# EAGLE design New_SERV_OPEN8_SOTB (EAGLE 9.6.2)
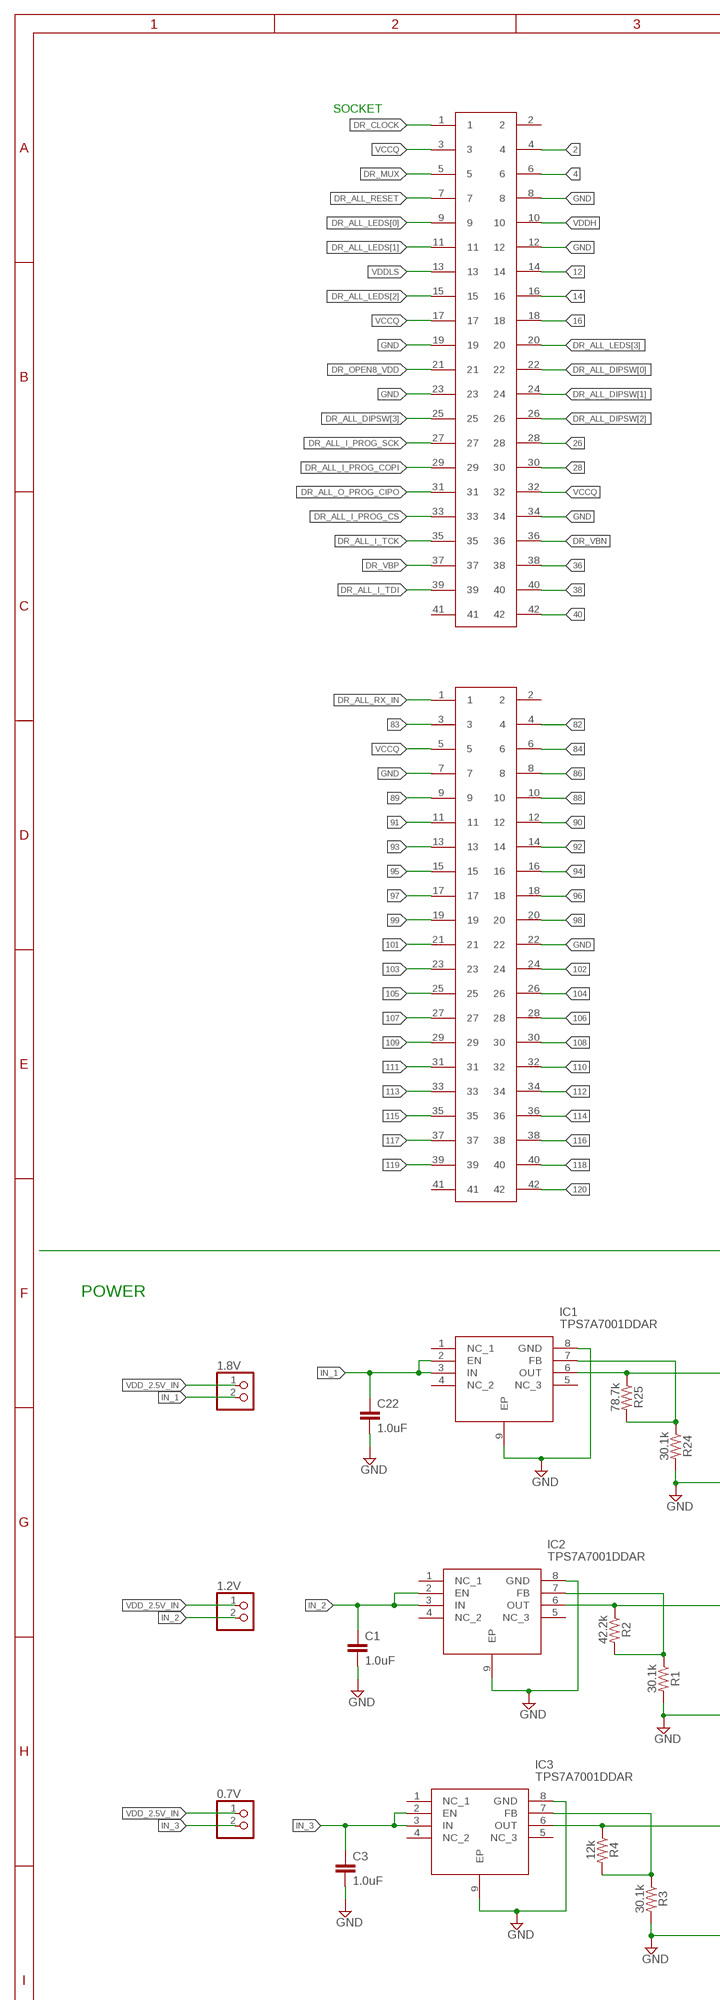
[diagram p0: schematic, sheet 1, part 1 of 2]
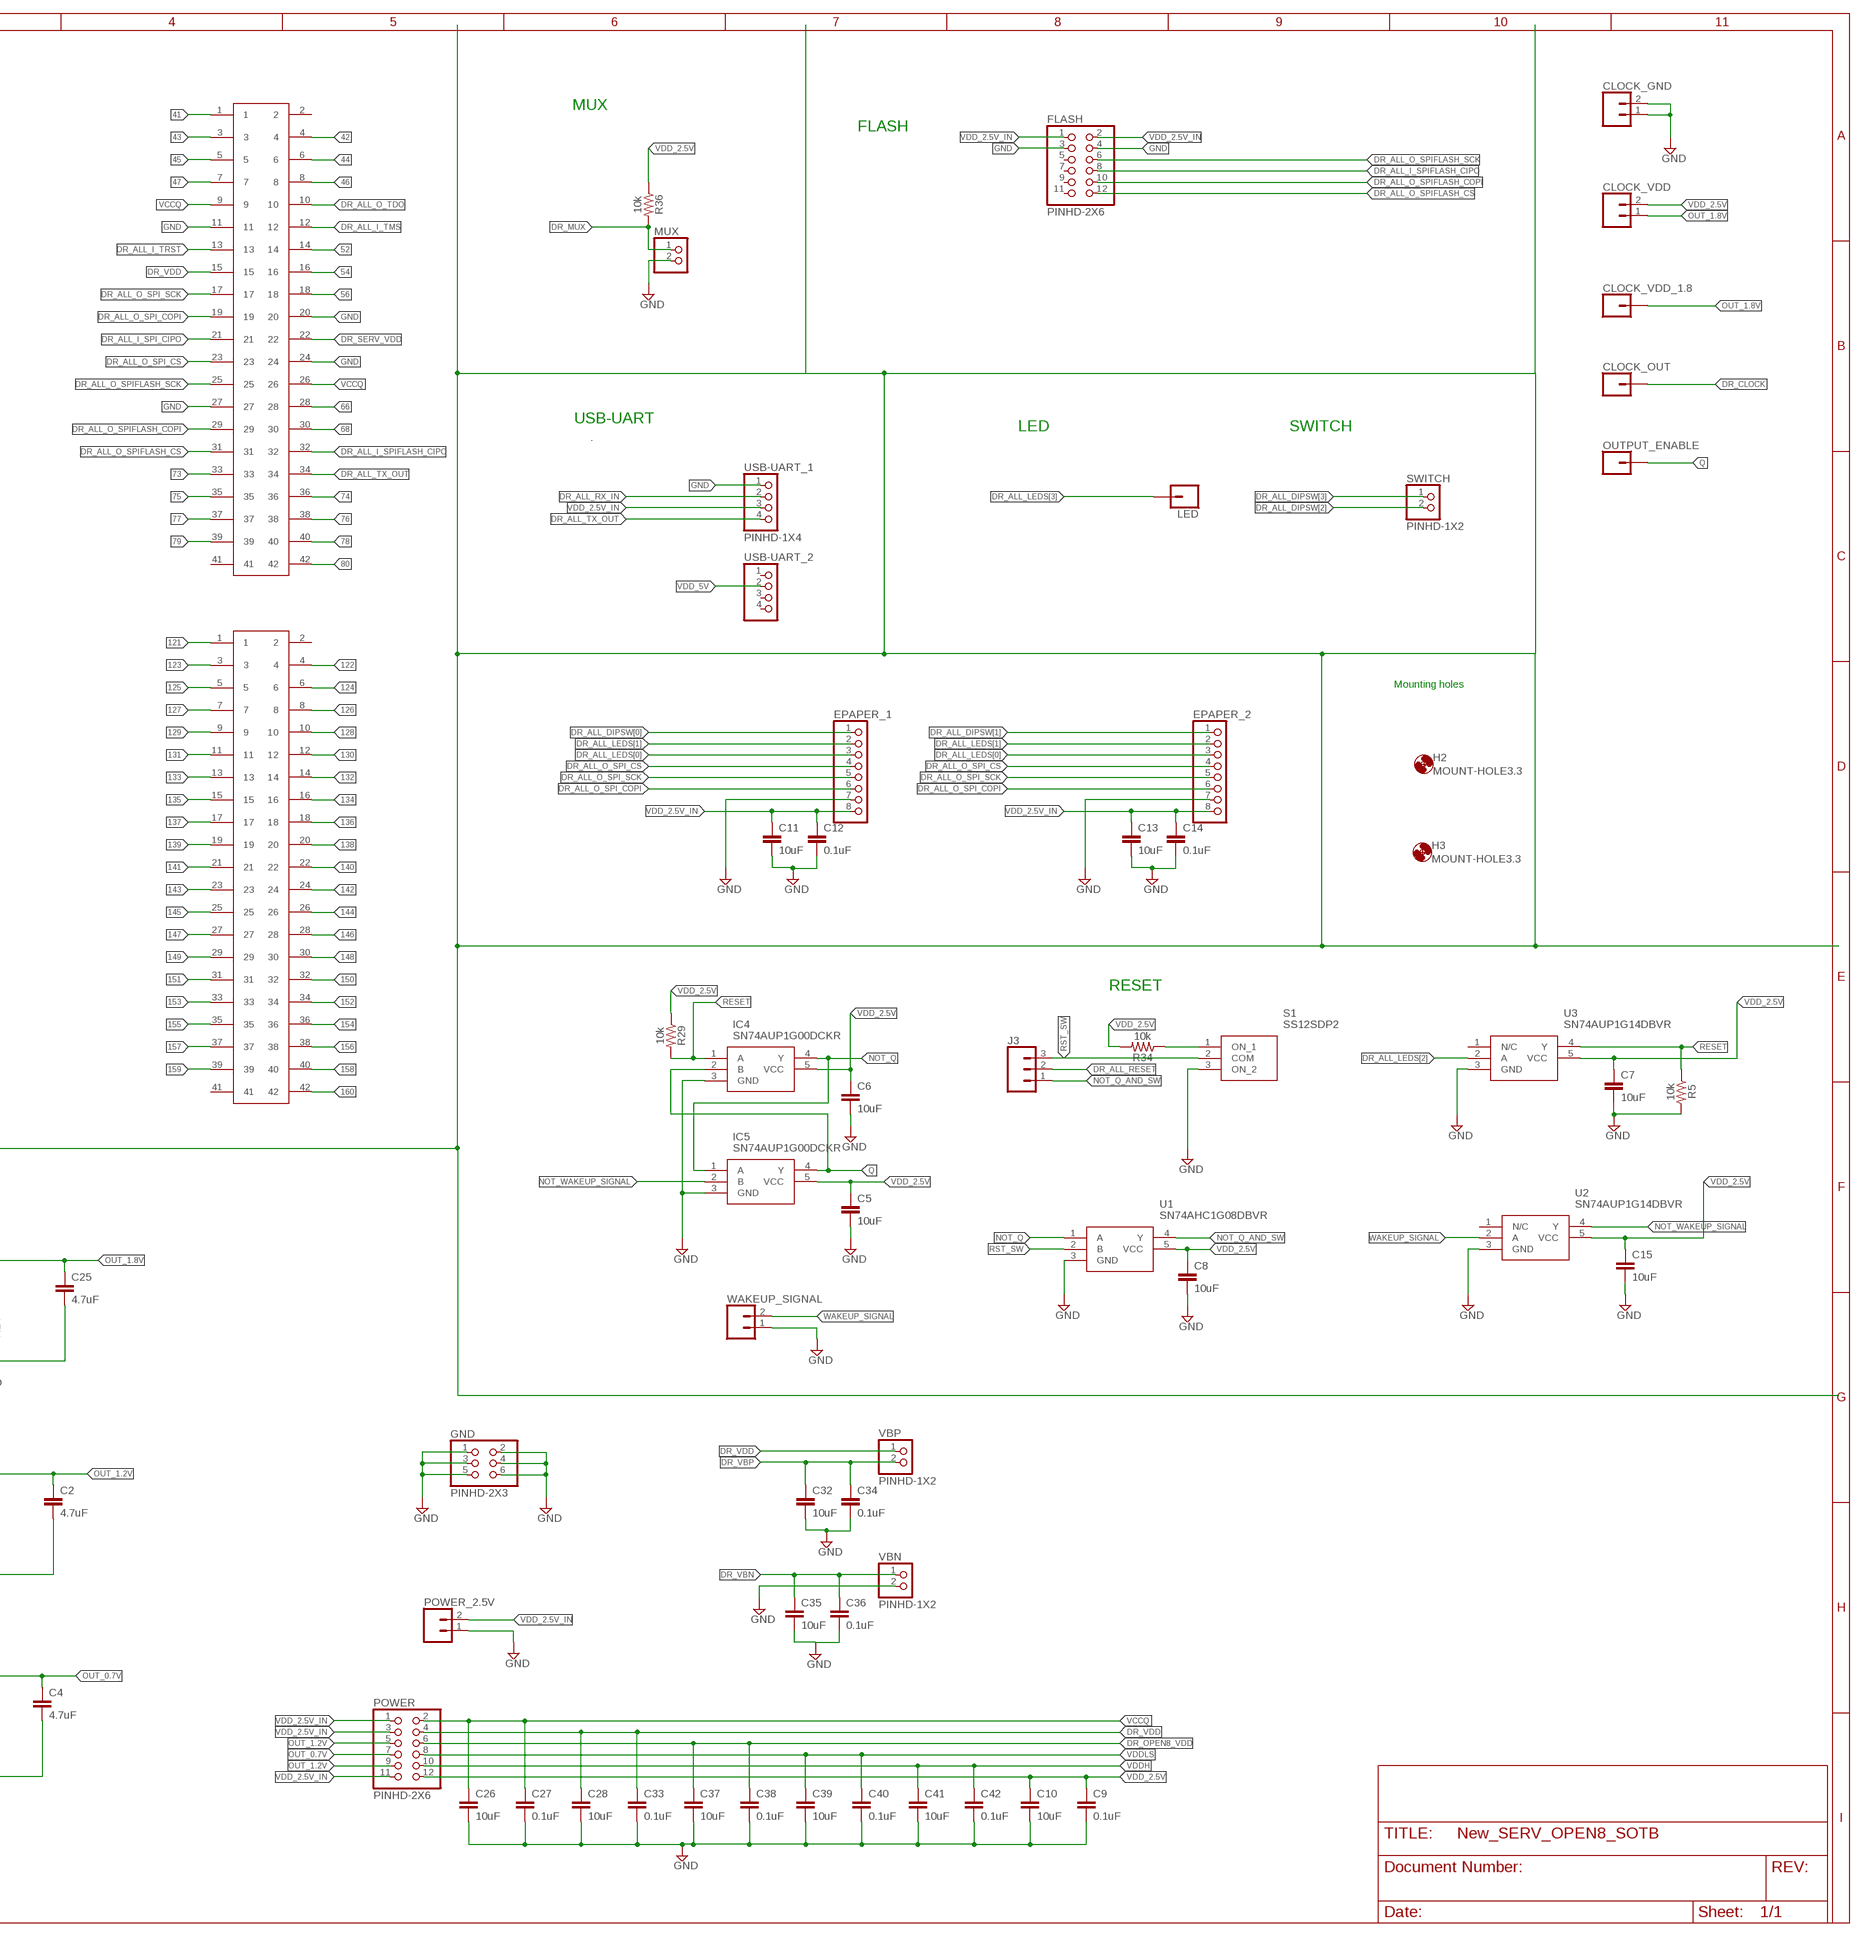
[diagram p1: schematic, sheet 1, part 2 of 2]

## Parts
0.7V  PINHD-1X2  [1X02]
1.2V  PINHD-1X2  [1X02]
1.8V  PINHD-1X2  [1X02]
C1  1.0uF  1.0UF-0805-25V-(+80/-20%)  [0805]
C2  4.7uF  1.0UF-0805-25V-(+80/-20%)  [0805]
C3  1.0uF  1.0UF-0805-25V-(+80/-20%)  [0805]
C4  4.7uF  1.0UF-0805-25V-(+80/-20%)  [0805]
C5  10uF  1.0UF-0805-25V-(+80/-20%)  [0805]
C6  10uF  1.0UF-0805-25V-(+80/-20%)  [0805]
C7  10uF  1.0UF-0805-25V-(+80/-20%)  [0805]
C8  10uF  1.0UF-0805-25V-(+80/-20%)  [0805]
C9  0.1uF  1.0UF-0805-25V-(+80/-20%)  [0805]
C10  10uF  1.0UF-0805-25V-(+80/-20%)  [0805]
C11  10uF  1.0UF-0805-25V-(+80/-20%)  [0805]
C12  0.1uF  1.0UF-0805-25V-(+80/-20%)  [0805]
C13  10uF  1.0UF-0805-25V-(+80/-20%)  [0805]
C14  0.1uF  1.0UF-0805-25V-(+80/-20%)  [0805]
C15  10uF  1.0UF-0805-25V-(+80/-20%)  [0805]
C22  1.0uF  1.0UF-0805-25V-(+80/-20%)  [0805]
C25  4.7uF  1.0UF-0805-25V-(+80/-20%)  [0805]
C26  10uF  1.0UF-0805-25V-(+80/-20%)  [0805]
C27  0.1uF  1.0UF-0805-25V-(+80/-20%)  [0805]
C28  10uF  1.0UF-0805-25V-(+80/-20%)  [0805]
C32  10uF  1.0UF-0805-25V-(+80/-20%)  [0805]
C33  0.1uF  1.0UF-0805-25V-(+80/-20%)  [0805]
C34  0.1uF  1.0UF-0805-25V-(+80/-20%)  [0805]
C35  10uF  1.0UF-0805-25V-(+80/-20%)  [0805]
C36  0.1uF  1.0UF-0805-25V-(+80/-20%)  [0805]
C37  10uF  1.0UF-0805-25V-(+80/-20%)  [0805]
C38  0.1uF  1.0UF-0805-25V-(+80/-20%)  [0805]
C39  10uF  1.0UF-0805-25V-(+80/-20%)  [0805]
C40  0.1uF  1.0UF-0805-25V-(+80/-20%)  [0805]
C41  10uF  1.0UF-0805-25V-(+80/-20%)  [0805]
C42  0.1uF  1.0UF-0805-25V-(+80/-20%)  [0805]
CLOCK_GND  CONN_02  [1X02]
CLOCK_OUT  CONN_01  [1X01]
CLOCK_VDD  CONN_02  [1X02]
CLOCK_VDD_1.8  CONN_01  [1X01]
EPAPER_1  PINHD-1X8  [1X08]
EPAPER_2  PINHD-1X8  [1X08]
FLASH  PINHD-2X6  [2X06]
GND  PINHD-2X3  [2X03]
H2  MOUNT-HOLE3.3  [3,3]
H3  MOUNT-HOLE3.3  [3,3]
IC1  TPS7A7001DDAR  [SOIC127P600X170-9N]
IC2  TPS7A7001DDAR  [SOIC127P600X170-9N]
IC3  TPS7A7001DDAR  [SOIC127P600X170-9N]
IC4  SN74AUP1G00DCKR  [SOT65P210X110-5N]
IC5  SN74AUP1G00DCKR  [SOT65P210X110-5N]
J3  CONN_03  [1X03]
LED  CONN_01  [1X01]
MUX  PINHD-1X2  [1X02]
OUTPUT_ENABLE  CONN_01  [1X01]
POWER  PINHD-2X6  [2X06]
POWER_2.5V  CONN_02  [1X02]
R1  30.1k  0.3OHM-0805-1/8W-1%  [0805]
R2  42.2k  0.3OHM-0805-1/8W-1%  [0805]
R3  30.1k  0.3OHM-0805-1/8W-1%  [0805]
R4  12k  0.3OHM-0805-1/8W-1%  [0805]
R5  10k  0.3OHM-0805-1/8W-1%  [0805]
R24  30.1k  0.3OHM-0805-1/8W-1%  [0805]
R25  78.7k  0.3OHM-0805-1/8W-1%  [0805]
R29  10k  0.3OHM-0805-1/8W-1%  [0805]
R34  10k  0.3OHM-0805-1/8W-1%  [0805]
R36  10k  0.3OHM-0805-1/8W-1%  [0805]
S1  SS12SDP2  [SS12SDP2]
SWITCH  PINHD-1X2  [1X02]
U1  SN74AHC1G08DBVR  [SOT95P280X145-5N]
U2  SN74AUP1G14DBVR  [SOT65P210X110-5N]
U3  SN74AUP1G14DBVR  [SOT65P210X110-5N]
U$1  2X41_HEADER  [2X41_HEADER]
U$2  2X41_HEADER  [2X41_HEADER]
U$3  2X41_HEADER  [2X41_HEADER]
U$4  2X41_HEADER  [2X41_HEADER]
USB-UART_1  PINHD-1X4  [1X04]
USB-UART_2  PINHD-1X4  [1X04]
VBN  PINHD-1X2  [1X02]
VBP  PINHD-1X2  [1X02]
WAKEUP_SIGNAL  CONN_02  [1X02]

## Nets
2: U$1.4
4: U$1.6
12: U$1.14
14: U$1.16
16: U$1.18
26: U$1.28
28: U$1.30
36: U$1.38
38: U$1.40
40: U$1.42
41: U$2.1
42: U$2.4
43: U$2.3
44: U$2.6
45: U$2.5
46: U$2.8
47: U$2.7
52: U$2.14
54: U$2.16
56: U$2.18
66: U$2.28
68: U$2.30
73: U$2.33
74: U$2.36
75: U$2.35
76: U$2.38
77: U$2.37
78: U$2.40
79: U$2.39
80: U$2.42
82: U$3.4
83: U$3.3
84: U$3.6
86: U$3.8
88: U$3.10
89: U$3.9
90: U$3.12
91: U$3.11
92: U$3.14
93: U$3.13
94: U$3.16
95: U$3.15
96: U$3.18
97: U$3.17
98: U$3.20
99: U$3.19
101: U$3.21
102: U$3.24
103: U$3.23
104: U$3.26
105: U$3.25
106: U$3.28
107: U$3.27
108: U$3.30
109: U$3.29
110: U$3.32
111: U$3.31
112: U$3.34
113: U$3.33
114: U$3.36
115: U$3.35
116: U$3.38
117: U$3.37
118: U$3.40
119: U$3.39
120: U$3.42
121: U$4.1
122: U$4.4
123: U$4.3
124: U$4.6
125: U$4.5
126: U$4.8
127: U$4.7
128: U$4.10
129: U$4.9
130: U$4.12
131: U$4.11
132: U$4.14
133: U$4.13
134: U$4.16
135: U$4.15
136: U$4.18
137: U$4.17
138: U$4.20
139: U$4.19
140: U$4.22
141: U$4.21
142: U$4.24
143: U$4.23
144: U$4.26
145: U$4.25
146: U$4.28
147: U$4.27
148: U$4.30
149: U$4.29
150: U$4.32
151: U$4.31
152: U$4.34
153: U$4.33
154: U$4.36
155: U$4.35
156: U$4.38
157: U$4.37
158: U$4.40
159: U$4.39
160: U$4.42
DR_ALL_DIPSW[0]: EPAPER_1.1 U$1.22
DR_ALL_DIPSW[1]: EPAPER_2.1 U$1.24
DR_ALL_DIPSW[2]: SWITCH.2 U$1.26
DR_ALL_DIPSW[3]: SWITCH.1 U$1.25
DR_ALL_I_PROG_COPI: U$1.29
DR_ALL_I_PROG_CS: U$1.33
DR_ALL_I_PROG_SCK: U$1.27
DR_ALL_I_SPI_CIPO: U$2.21
DR_ALL_I_SPIFLASH_CIPO: FLASH.8 U$2.32
DR_ALL_I_TCK: U$1.35
DR_ALL_I_TDI: U$1.39
DR_ALL_I_TMS: U$2.12
DR_ALL_I_TRST: U$2.13
DR_ALL_LEDS[0]: EPAPER_1.3 EPAPER_2.3 U$1.9
DR_ALL_LEDS[1]: EPAPER_1.2 EPAPER_2.2 U$1.11
DR_ALL_LEDS[2]: U3.2(A) U$1.15
DR_ALL_LEDS[3]: LED.1 U$1.20
DR_ALL_O_PROG_CIPO: U$1.31
DR_ALL_O_SPI_COPI: EPAPER_1.6 EPAPER_2.6 U$2.19
DR_ALL_O_SPI_CS: EPAPER_1.4 EPAPER_2.4 U$2.23
DR_ALL_O_SPI_SCK: EPAPER_1.5 EPAPER_2.5 U$2.17
DR_ALL_O_SPIFLASH_COPI: FLASH.10 U$2.29
DR_ALL_O_SPIFLASH_CS: FLASH.12 U$2.31
DR_ALL_O_SPIFLASH_SCK: FLASH.6 U$2.25
DR_ALL_O_TDO: U$2.10
DR_ALL_RESET: J3.2 U$1.7
DR_ALL_RX_IN: U$3.1 USB-UART_1.2
DR_ALL_TX_OUT: U$2.34 USB-UART_1.4
DR_CLOCK: CLOCK_OUT.1 U$1.1
DR_MUX: MUX.1 R36.2 U$1.5
DR_OPEN8_VDD: C37.1 C38.1 POWER.6 U$1.21
DR_SERV_VDD: U$2.22
DR_VBN: C35.1 C36.1 U$1.36 VBN.1
DR_VBP: C32.1 C34.1 U$1.37 VBP.2
DR_VDD: C28.1 C33.1 POWER.4 U$2.15 VBP.1
GND: C1.2 C2.2 C3.2 C4.2 C5.2 C6.2 C7.2 C8.2 C9.2 C10.2 C11.2 C12.2 C13.2 C14.2 C15.2 C22.2 C25.2 C26.2 C27.2 C28.2 C32.2 C33.2 C34.2 C35.2 C36.2 C37.2 C38.2 C39.2 C40.2 C41.2 C42.2 CLOCK_GND.1 CLOCK_GND.2 EPAPER_1.7 EPAPER_2.7 FLASH.3 FLASH.4 GND.1 GND.2 GND.3 GND.4 GND.5 GND.6 IC1.8(GND) IC1.9(EP) IC2.8(GND) IC2.9(EP) IC3.8(GND) IC3.9(EP) IC4.3(GND) IC5.3(GND) MUX.2 POWER_2.5V.1 R1.2 R3.2 R5.2 R24.2 S1.3(ON_2) U1.3(GND) U2.3(GND) U3.3(GND) U$1.8 U$1.12 U$1.19 U$1.23 U$1.34 U$2.11 U$2.20 U$2.24 U$2.27 U$3.7 U$3.22 USB-UART_1.1 VBN.2 WAKEUP_SIGNAL.1
IN_1: 1.8V.2 C22.1 IC1.2(EN) IC1.3(IN)
IN_2: 1.2V.2 C1.1 IC2.2(EN) IC2.3(IN)
IN_3: 0.7V.2 C3.1 IC3.2(EN) IC3.3(IN)
N$1: IC2.7(FB) R1.1 R2.2
N$2: IC3.7(FB) R3.1 R4.2
N$10: R34.1 S1.1(ON_1)
N$18: IC1.7(FB) R24.1 R25.2
NOT_Q: IC4.4(Y) IC5.1(A) U1.1(A)
NOT_Q_AND_SW: J3.1 U1.4(Y)
NOT_WAKEUP_SIGNAL: IC5.2(B) U2.4(Y)
OUT_0.7V: C4.1 IC3.6(OUT) POWER.7 R4.1
OUT_1.2V: C2.1 IC2.6(OUT) POWER.5 POWER.9 R2.1
OUT_1.8V: C25.1 CLOCK_VDD.1 CLOCK_VDD_1.8.1 IC1.6(OUT) R25.1
Q: IC4.2(B) IC5.4(Y) OUTPUT_ENABLE.1
RESET: IC4.1(A) R5.1 R29.2 U3.4(Y)
RST_SW: J3.3 S1.2(COM) U1.2(B)
VCCQ: C26.1 C27.1 POWER.2 U$1.3 U$1.17 U$1.32 U$2.9 U$2.26 U$3.5
VDD_2.5V: C5.1 C6.1 C7.1 C8.1 C9.1 C10.1 C15.1 CLOCK_VDD.2 IC4.5(VCC) IC5.5(VCC) POWER.12 R29.1 R34.2 R36.1 U1.5(VCC) U2.5(VCC) U3.5(VCC)
VDD_2.5V_IN: 0.7V.1 1.2V.1 1.8V.1 C11.1 C12.1 C13.1 C14.1 EPAPER_1.8 EPAPER_2.8 FLASH.1 FLASH.2 POWER.1 POWER.3 POWER.11 POWER_2.5V.2 USB-UART_1.3
VDD_5V: USB-UART_2.2
VDDH: C41.1 C42.1 POWER.10 U$1.10
VDDLS: C39.1 C40.1 POWER.8 U$1.13
WAKEUP_SIGNAL: U2.2(A) WAKEUP_SIGNAL.2
Unconnected: FLASH.5 FLASH.7 FLASH.9 FLASH.11 IC1.1(NC_1) IC1.4(NC_2) IC1.5(NC_3) IC2.1(NC_1) IC2.4(NC_2) IC2.5(NC_3) IC3.1(NC_1) IC3.4(NC_2) IC3.5(NC_3) U2.1(N/C) U3.1(N/C) U$1.2 U$1.41 U$2.2 U$2.41 U$3.2 U$3.41 U$4.2 U$4.41 USB-UART_2.1 USB-UART_2.3 USB-UART_2.4

## Notes on the sheet
- SOCKET
- MUX
- FLASH
- USB-UART
- LED | SWITCH
- Mounting holes
- RESET
- POWER

## Library data of the parts
0.7V 1.2V 1.8V MUX = pinhead:PINHD-1X2: PIN HEADER
C1 C3 C22 = SparkFun-Capacitors:1.0UF: 1µF ceramic capacitors A capacitor is a passive two-terminal electrical component used to store electrical energy temporarily in an electric field.; PROD_ID: CAP-11625
C2 C4-C15 C25-C28 C32-C42 = SparkFun-Capacitors:1.0UF: 1µF ceramic capacitors A capacitor is a passive two-terminal electrical component used to store electrical energy temporarily in an electric field.; PROD_ID: CAP-11625; VALUE: 1.0uF
CLOCK_GND CLOCK_VDD POWER_2.5V WAKEUP_SIGNAL = SparkFun-Connectors:CONN_02: Multi connection point. Often used as Generic Header-pin footprint for 0.1 inch spaced/style header connections On any of the 0.1 inch spaced packages, you can populate with these: Break Away Headers - Straight <https://www.sparkfun.com/products/116> (PRT-00116) Break Away Male Headers - Right Angle <https://www.sparkfun.com/products/553> (PRT-00553) Female Headers <https://www.sparkfun.com/products/115> (PRT-00115) Break Away Headers - Machine Pin <https://www.sparkfun.com/products/117> (PRT-00117) Break Away Female Headers - Swiss Machine Pin <https://www.sparkfun.com/products/743> (PRT-00743) For SCREWTERMINALS and SPRING TERMINALS visit here: Screw Terimnals on SparkFun.com <https://www.sparkfun.com/search/results?term=Screw+Terminals> (5mm/3.5mm/2.54mm spacing) This device is also useful as a general connection point to wire up your design to another part of your project. Our various solder wires solder well into these plated through hole pads. Hook-Up Wire - Assortment (Stranded, 22 AWG) <https://www.sparkfun.com/products/11375> (PRT-11375) Hook-Up Wire - Assortment (Solid Core, 22 AWG) <https://www.sparkfun.com/products/11367> (PRT-11367) View the entire wire category on our website here <https://www.sparkfun.com/categories/141> Special notes: Molex polarized connector foot print use with: PRT-08233 with associated crimp pins and housings. 2.54_SCREWTERM for use with PRT-10571. 3.5mm Screw Terminal footprints for PRT-08084 5mm Screw Terminal footprints for use with PRT-08432
CLOCK_OUT CLOCK_VDD_1.8 LED OUTPUT_ENABLE = SparkFun-Connectors:CONN_01: Single connection point. Often used as Generic Header-pin footprint for 0.1 inch spaced/style header connections On any of the 0.1 inch spaced packages, you can populate with these: Break Away Headers - Straight <https://www.sparkfun.com/products/116> (PRT-00116) Break Away Male Headers - Right Angle <https://www.sparkfun.com/products/553> (PRT-00553) Female Headers <https://www.sparkfun.com/products/115> (PRT-00115) Break Away Headers - Machine Pin <https://www.sparkfun.com/products/117> (PRT-00117) Break Away Female Headers - Swiss Machine Pin <https://www.sparkfun.com/products/743> (PRT-00743) This device is also useful as a general connection point to wire up your design to another part of your project. Our various solder wires solder well into these plated through hole pads. Hook-Up Wire - Assortment (Stranded, 22 AWG) <https://www.sparkfun.com/products/11375> (PRT-11375) Hook-Up Wire - Assortment (Solid Core, 22 AWG) <https://www.sparkfun.com/products/11367> (PRT-11367) View the entire wire category on our website here <https://www.sparkfun.com/categories/141> Special notes: SMTSO-256-ET is a "flush mount" nut for a 4-40 screw. We mostly use this on specialty testbeds; it is a nice way to connect hardware to your PCB at an adjustable hieght. Also note, the SNAP packages are for using a snappable style connector. We sell a baggie of snaps and they are also used on two LilyPad designs: Snap Assortment - 30 pack (male and female) <https://www.sparkfun.com/products/11347> (DEV-11347) LilyPad Arduino SimpleSnap <https://www.sparkfun.com/products/10941> (DEV-10941) LilyPad SimpleSnap Protoboard <https://www.sparkfun.com/products/10940> (DEV-10940)
EPAPER_1 EPAPER_2 = pinhead:PINHD-1X8: PIN HEADER
FLASH POWER = Connector:PINHD-2X6: PIN HEADER; CATEGORY: CONNECTOR; SUB-CATEGORY: PIN-HEADER
GND = Connector:PINHD-2X3: PIN HEADER; CATEGORY: CONNECTOR; SUB-CATEGORY: PIN-HEADER
H2 H3 = holes:MOUNT-HOLE: MOUNTING HOLE with drill center marker
IC1-IC3 = SamacSys_Parts:TPS7A7001DDAR: LDO Voltage Regulators 2A,Sgl Out,Very Lo Inp,Adj LDO Lin Reg Source: Datasheet <http://www.ti.com/lit/ds/symlink/tps7a7001.pdf>; ARROW_PART_NUMBER: TPS7A7001DDAR; ARROW_PRICE-STOCK: https://www.arrow.com/en/products/tps7a7001ddar/texas-instruments; DESCRIPTION: LDO Voltage Regulators 2A,Sgl Out,Very Lo Inp,Adj LDO Lin Reg; HEIGHT: 1.7mm; MANUFACTURER_NAME: Texas Instruments; MANUFACTURER_PART_NUMBER: TPS7A7001DDAR; MOUSER_PART_NUMBER: 595-TPS7A7001DDAR; MOUSER_PRICE-STOCK: https://www.mouser.co.uk/ProductDetail/Texas-Instruments/TPS7A7001DDAR?qs=xAPdowV%2FOLRX3MQ1h5BpFw%3D%3D
IC4 IC5 = SamacSys_Parts:SN74AUP1G00DCKR: Low-Power Single Two-Input Positive-NAND Gate Source: Datasheet <http://www.ti.com/lit/gpn/sn74aup1g00>; ARROW_PART_NUMBER: SN74AUP1G00DCKR; ARROW_PRICE-STOCK: https://www.arrow.com/en/products/sn74aup1g00dckr/texas-instruments; DESCRIPTION: Low-Power Single Two-Input Positive-NAND Gate; HEIGHT: 1.1mm; MANUFACTURER_NAME: Texas Instruments; MANUFACTURER_PART_NUMBER: SN74AUP1G00DCKR; MOUSER_PART_NUMBER: 595-SN74AUP1G00DCKR; MOUSER_PRICE-STOCK: https://www.mouser.co.uk/ProductDetail/Texas-Instruments/SN74AUP1G00DCKR?qs=iO7mgM19OaY6H4H9CbnK7w%3D%3D
J3 = SparkFun-Connectors:CONN_03: Multi connection point. Often used as Generic Header-pin footprint for 0.1 inch spaced/style header connections On any of the 0.1 inch spaced packages, you can populate with these: Break Away Headers - Straight <https://www.sparkfun.com/products/116> (PRT-00116) Break Away Male Headers - Right Angle <https://www.sparkfun.com/products/553> (PRT-00553) Female Headers <https://www.sparkfun.com/products/115> (PRT-00115) Break Away Headers - Machine Pin <https://www.sparkfun.com/products/117> (PRT-00117) Break Away Female Headers - Swiss Machine Pin <https://www.sparkfun.com/products/743> (PRT-00743) Stackable Header - 3 Pin (Female, 0.1") <https://www.sparkfun.com/products/13875> (PRT-13875) For SCREWTERMINALS and SPRING TERMINALS visit here: Screw Terimnals on SparkFun.com <https://www.sparkfun.com/search/results?term=Screw+Terminals> (5mm/3.5mm/2.54mm spacing) This device is also useful as a general connection point to wire up your design to another part of your project. Our various solder wires solder well into these plated through hole pads. Hook-Up Wire - Assortment (Stranded, 22 AWG) <https://www.sparkfun.com/products/11375> (PRT-11375) Hook-Up Wire - Assortment (Solid Core, 22 AWG) <https://www.sparkfun.com/products/11367> (PRT-11367) View the entire wire category on our website here <https://www.sparkfun.com/categories/141> Special notes: Molex polarized connector foot print use with SKU : PRT-08232 with associated crimp pins and housings.
R1-R5 R24 R25 R29 R34 R36 = SparkFun-Resistors:0.3OHM: 0.3Ω resistor A resistor is a passive two-terminal electrical component that implements electrical resistance as a circuit element. Resistors act to reduce current flow, and, at the same time, act to lower voltage levels within circuits. - Wikipedia; PROD_ID: RES-11622; VALUE: 0.3
S1 = SamacSys_Parts:SS12SDP2: Switch, Slide,Sub Miniature,Top Actuated,SPDT, On-none-On Source: Datasheet; DESCRIPTION: Switch, Slide,Sub Miniature,Top Actuated,SPDT, On-none-On; HEIGHT: 4mm; MANUFACTURER_NAME: NKK Switches; MANUFACTURER_PART_NUMBER: SS12SDP2; MOUSER_PART_NUMBER: 633-SS12SDP2; MOUSER_PRICE-STOCK: https://www.mouser.co.uk/ProductDetail/NKK-Switches/SS12SDP2?qs=Av7JdS0MGqKsG%252BWOKKtU2w%3D%3D
SWITCH VBN VBP = Connector:PINHD-1X2: PIN HEADER; CATEGORY: CONNECTOR; SUB-CATEGORY: PIN-HEADER
U1 = SamacSys_Parts:SN74AHC1G08DBVR: Texas Instruments SN74AHC1G08DBVR, 2-Input AND Logic Gate, 2 5.5 V, 5-Pin SOT-23 Source: Datasheet <http://www.ti.com/general/docs/lit/getliterature.tsp?genericPartNumber=SN74AHC1G08&&fileType=pdf>; ARROW_PART_NUMBER: SN74AHC1G08DBVR; ARROW_PRICE-STOCK: https://www.arrow.com/en/products/sn74ahc1g08dbvr/texas-instruments?region=nac; DESCRIPTION: Texas Instruments SN74AHC1G08DBVR, 2-Input AND Logic Gate, 2 5.5 V, 5-Pin SOT-23; HEIGHT: 1.45mm; MANUFACTURER_NAME: Texas Instruments; MANUFACTURER_PART_NUMBER: SN74AHC1G08DBVR; MOUSER_PART_NUMBER: 595-SN74AHC1G08DBVR; MOUSER_PRICE-STOCK: https://www.mouser.co.uk/ProductDetail/Texas-Instruments/SN74AHC1G08DBVR?qs=tJ5HNKWh3OXzGHgsEkuHbw%3D%3D
U2 U3 = SamacSys_Parts:SN74AUP1G14DBVR: Low-Power Single Schmitt-Trigger Inverter Source: Datasheet <http://www.ti.com/lit/ds/symlink/sn74aup1g14.pdf>; ARROW_PART_NUMBER: SN74AUP1G14DBVR; ARROW_PRICE-STOCK: https://www.arrow.com/en/products/sn74aup1g14dbvr/texas-instruments?region=nac; DESCRIPTION: Low-Power Single Schmitt-Trigger Inverter; HEIGHT: 1.1mm; MANUFACTURER_NAME: Texas Instruments; MANUFACTURER_PART_NUMBER: SN74AUP1G14DBVR; MOUSER_PART_NUMBER: 595-SN74AUP1G14DBVR; MOUSER_PRICE-STOCK: https://www.mouser.co.uk/ProductDetail/Texas-Instruments/SN74AUP1G14DBVR?qs=X3IDIfI%252BJAUKbJXbV%252BNpVw%3D%3D
U$1-U$4 = Duy:2X41_HEADER
USB-UART_1 USB-UART_2 = Connector:PINHD-1X4: PIN HEADER; CATEGORY: CONNECTOR; SUB-CATEGORY: PIN-HEADER

## Board
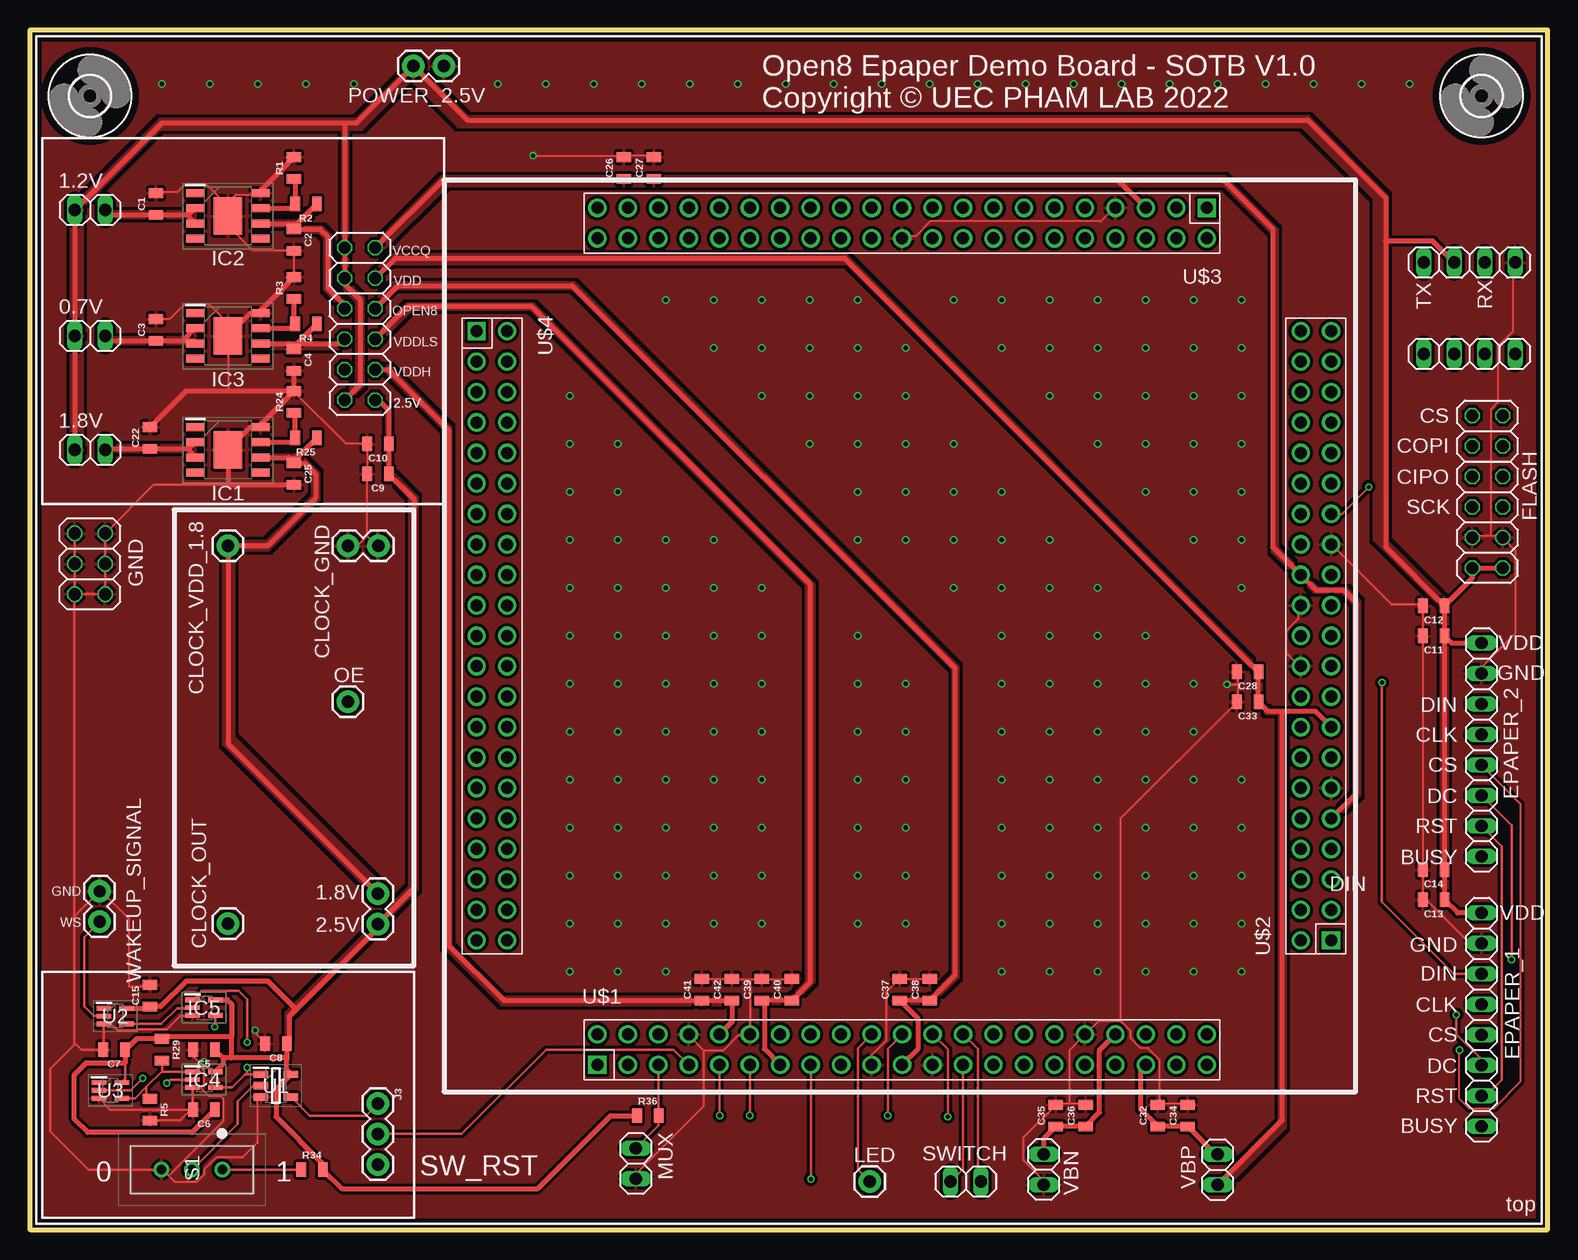
[diagram p2: board, top side]
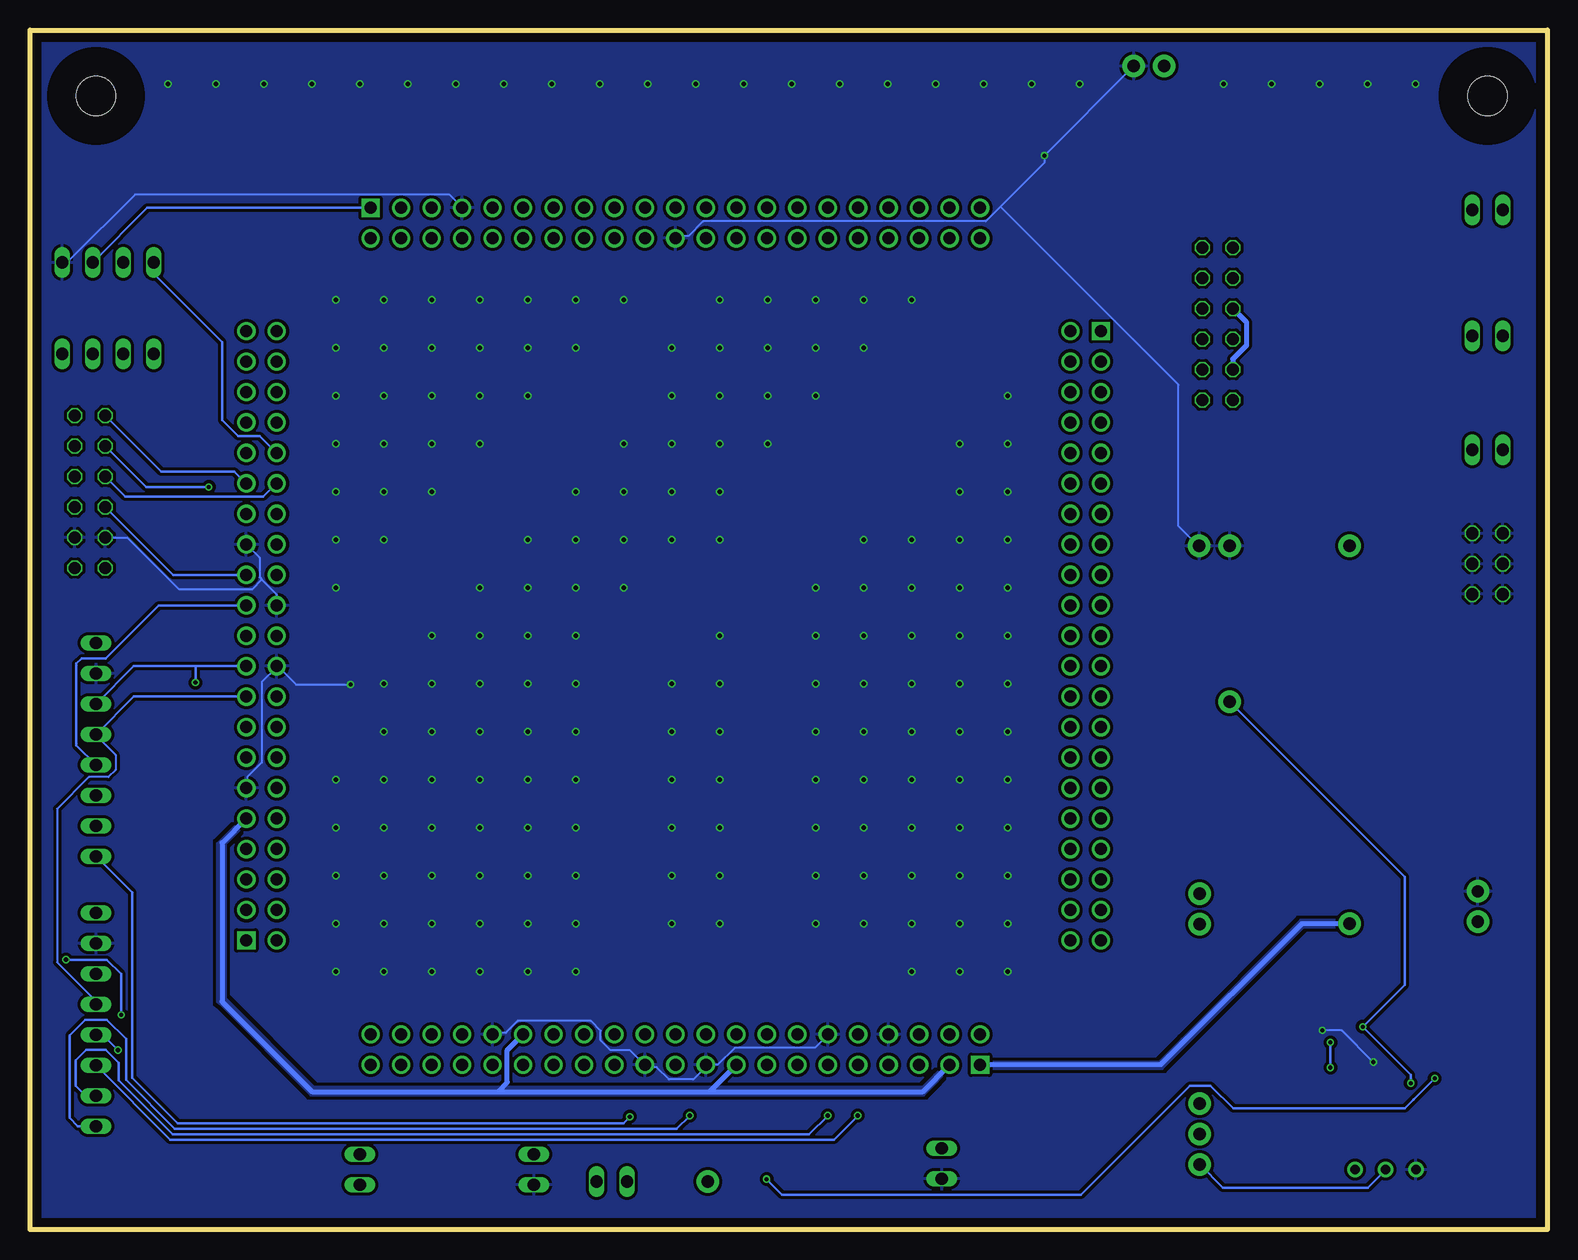
[diagram p3: board, bottom side, seen from below]

Size 126.5 x 100 mm. Coordinates in mm from the lower left corner, seen from the top.
Outline: 0,0 126.5,0 126.5,100 0,100 0,0
Copper layers (1*16): Top 0.035mm / dielectric 1.5mm / Bottom 0.035mm
Design rules "default *": minimum track width 6mil, minimum drill 0.35mm, track to track 10mil, track to pad 10mil, pad to pad 6mil, via to via 10mil, smd to smd 10mil, copper to edge 30mil, drill to drill 6mil, minimum pad ring 0.13mm, minimum via ring 0.13mm, stop-mask expansion 4mil, vias tented up to drill 0mil, thermal gap 10mil

### Footprints (pad centres in the part's own frame; a part is rotated, then mirrored left to right if it is on the bottom)
1X02 = drill 1.016 long: 1 -1.27,0; 2 1.27,0
0805 = smd 0.8 x 1.2: 1 -0.9,0; 2 0.9,0
1X02' = drill 1.016 pad 1.88: 1 0,0; 2 2.54,0
1X01 = drill 1.016 pad 1.88: 1 0,0
1X08 = drill 1.016 long: 1 -8.89,0; 2 -6.35,0; 3 -3.81,0; 4 -1.27,0; 5 1.27,0; 6 3.81,0; 7 6.35,0; 8 8.89,0
2X06 = drill 1.016 octagon: 1 -6.35,-1.27; 2 -6.35,1.27; 3 -3.81,-1.27; 4 -3.81,1.27; 5 -1.27,-1.27; 6 -1.27,1.27; 7 1.27,-1.27; 8 1.27,1.27; 9 3.81,-1.27; 10 3.81,1.27; 11 6.35,-1.27; 12 6.35,1.27
2X03 = drill 1.016 octagon: 1 -2.54,-1.27; 2 -2.54,1.27; 3 0,-1.27; 4 0,1.27; 5 2.54,-1.27; 6 2.54,1.27
3,3 = hole 3.3: 0,0
SOIC127P600X170-9N = smd 1.525 x 0.65: 1 -2.712,1.905; 2 -2.712,0.635; 3 -2.712,-0.635; 4 -2.712,-1.905; 5 2.712,-1.905; 6 2.712,-0.635; 7 2.712,0.635; 8 2.712,1.905 | smd 2.4 x 3.1: 9 0,0
SOT65P210X110-5N = smd 1.2 x 0.4: 1 -0.95,0.65; 2 -0.95,0; 3 -0.95,-0.65; 4 0.95,-0.65; 5 0.95,0.65
1X03 = drill 1.016 pad 1.88: 1 0,0; 2 2.54,0; 3 5.08,0
SS12SDP2 = drill 0.8 pad 1.3: 1 0,2.54; 2 0,0; 3 0,-2.54
SOT95P280X145-5N = smd 1.2 x 0.6: 1 -1.25,0.95; 2 -1.25,0; 3 -1.25,-0.95; 4 1.25,-0.95; 5 1.25,0.95
2X41_HEADER = drill 1 pad 1.524 square: 1 -25.4,-1.27 | drill 1 pad 1.524: 2 -25.4,1.27; 3 -22.86,-1.27; 4 -22.86,1.27; 5 -20.32,-1.27; 6 -20.32,1.27; 7 -17.78,-1.27; 8 -17.78,1.27; 9 -15.24,-1.27; 10 -15.24,1.27; 11 -12.7,-1.27; 12 -12.7,1.27; 13 -10.16,-1.27; 14 -10.16,1.27; 15 -7.62,-1.27; 16 -7.62,1.27; 17 -5.08,-1.27; 18 -5.08,1.27; 19 -2.54,-1.27; 20 -2.54,1.27; 21 0,-1.27; 22 0,1.27; 23 2.54,-1.27; 24 2.54,1.27; 25 5.08,-1.27; 26 5.08,1.27; 27 7.62,-1.27; 28 7.62,1.27; 29 10.16,-1.27; 30 10.16,1.27; 31 12.7,-1.27; 32 12.7,1.27; 33 15.24,-1.27; 34 15.24,1.27; 35 17.78,-1.27; 36 17.78,1.27; 37 20.32,-1.27; 38 20.32,1.27; 39 22.86,-1.27; 40 22.86,1.27; 41 25.4,-1.27; 42 25.4,1.27
1X04 = drill 1.016 long: 1 -3.81,0; 2 -1.27,0; 3 1.27,0; 4 3.81,0

### Placement (x,y rotation side)
0.7V  5,74.5 0 top
1.2V  5,85 0 top
1.8V  5,65 0 top
C1  10.5,85.5 90 top
C2  22,82.5 270 top
C3  10.5,75 90 top
C4  22,72.5 270 top
C5  14.5,15 180 top
C6  14.5,10 180 top
C7  7,15 180 top
C8  20.5,15.5 180 top
C9  29,63 180 top
C10  29,65.5 180 top
C11  117,49.5 180 top
C12  117,52 180 top
C13  117,27.5 180 top
C14  117,30 180 top
C15  10,19.5 90 top
C22  10,66 90 top
C25  22,63 270 top
C26  49.5,88.5 90 top
C27  52,88.5 90 top
C28  101.5,46.5 180 top
C32  94,9.5 90 top
C33  101.5,44 180 top
C34  96.5,9.5 90 top
C35  85.5,9.5 90 top
C36  88,9.5 90 top
C37  72.5,20 90 top
C38  75,20 90 top
C39  61,20 90 top
C40  63.5,20 90 top
C41  56,20 90 top
C42  58.5,20 90 top
CLOCK_GND  [1X02']  26.5,57 0 top
CLOCK_OUT  16.5,25.5 0 top
CLOCK_VDD  [1X02']  29,28 270 top
CLOCK_VDD_1.8  16.5,57 0 top
EPAPER_1  121,17.5 90 top
EPAPER_2  121,40 90 top
FLASH  121.5,61.5 90 top
GND  5,55.5 90 top
H2  121,94.5 0 top
H3  5,94.5 0 top
IC1  16.5,65 0 top
IC2  16.5,84.5 0 top
IC3  16.5,74.5 0 top
IC4  14.5,12.5 0 top
IC5  14.5,18.5 0 top
J3  29,10.5 270 top
LED  70,4 0 top
MUX  50.5,5.5 270 top
OUTPUT_ENABLE  26.5,44 0 top
POWER  27.5,75.5 270 top
POWER_2.5V  [1X02']  34.5,97 180 top
R1  22,88.5 90 top
R2  23,85.5 180 top
R3  22,78.5 90 top
R4  23,75.5 180 top
R5  10,10 270 top
R24  22,69 90 top
R25  23,66 180 top
R29  11,15 270 top
R34  23.5,5 0 top
R36  51.5,9.5 0 top
S1  13.5,5 270 top
SWITCH  78,4 0 top
U1  20.5,12 0 top
U2  7.1,17.8 0 top
U3  6.7,11.6 0 top
U$1  72.7,15 0 top
U$2  107.2,49.5 90 top
U$3  72.7,83.9 180 top
U$4  38.5,49.5 270 top
USB-UART_1  120,80.62 180 top
USB-UART_2  120,73 180 top
VBN  84.5,5 270 top
VBP  99,5 90 top
WAKEUP_SIGNAL  [1X02']  5.8,28.2 270 top

### Tracks (layer width: path | path; a pad name or v marks a point on that pad's centre or on a via)
DR_ALL_DIPSW[0]  (via drill 0.35)
  Top 0.2: U$1.22 71.5,15.07 v71.5,9.5
  Bottom 0.2: v71.5,9.5 72.59,8.41 114.43,8.41 118.5,12.47 118.5,15.9 120.1,17.5 121.9,17.5 123.2,16.2 123.2,9.3 122.51,8.61 EPAPER_1.1
DR_ALL_DIPSW[1]  (via drill 0.35)
  Top 0.2: U$1.24 76.5,15.01 v76.5,9.4
  Bottom 0.2: v76.5,9.4 77.04,8.86 114.2,8.86 118,12.66 118,28.11 EPAPER_2.1
DR_ALL_DIPSW[2]
  Top 0.2: U$1.26 79,15.05 79,4.27 SWITCH.2
DR_ALL_DIPSW[3]
  Top 0.2: U$1.25 77.78,5.03 76.75,4 SWITCH.1
DR_ALL_I_SPIFLASH_CIPO
  Bottom 0.2: FLASH.8 118.56,61.1 108.95,61.1 108.93,61.08 107.05,61.08 U$2.32
DR_ALL_LEDS[0]  (via drill 0.35)
  Top 0.2: U$1.9 57.46,9.54 v57.5,9.5 | EPAPER_1.3 121,14.19 118.9,16.29 v118.9,17.9 | EPAPER_2.3 123.5,33.69 v123.5,22.5
  Bottom 0.2: v57.5,9.5 59.5,7.5 114.81,7.5 EPAPER_1.3 | v123.5,22.5 120.1,22.5 118.9,21.3 v118.9,17.9
DR_ALL_LEDS[1]  (via drill 0.35)
  Top 0.2: U$1.11 v60,9.5 | EPAPER_2.2 122.7,31.95 122.7,12.5 121.35,11.15 EPAPER_1.2
  Bottom 0.2: v60,9.5 61.55,7.95 114.62,7.95 119.1,12.43 119.1,13.9 120.2,15 121.8,15 122.7,14.1 122.7,12 121.85,11.15 EPAPER_1.2
DR_ALL_LEDS[2]  (via drill 0.35)
  Top 0.2: U$1.15 65.1,13.71 v65.1,4.2 | U3.2 8.4,11.6 v9.4,12.6
  Bottom 0.2: v65.1,4.2 63.8,2.9 38.9,2.9 29.8,12 28.1,12 26.2,10.1 11.9,10.1 11.2,10.8 11.15,10.85 v9.4,12.6
DR_ALL_LEDS[3]
  Top 0.2: U$1.20 69,15.11 69,5 LED.1
DR_ALL_O_SPI_COPI  (via drill 0.35)
  Top 0.2: EPAPER_1.6 118.69,21.31 112.7,27.3 v112.7,45.6
  Bottom 0.2: EPAPER_2.6 117.85,46.96 112.7,46.96 | 112.7,46.96 U$2.19 | v112.7,45.6 112.7,46.96
DR_ALL_O_SPI_CS  (via drill 0.35)
  Top 0.152: v119.16,14.96 119.16,10.89 119.97,10.08 122,10.08 124.24,12.31 124.24,35.48 121.19,38.53 EPAPER_2.4
  Bottom 0.152: v119.16,14.96 120.38,16.17 120.99,16.17 EPAPER_1.4
  Bottom 0.2: U$2.23 115.76,52.04 120.2,47.6 122.2,47.6 122.63,47.17 122.63,40.36 EPAPER_2.4
DR_ALL_O_SPI_SCK
  Bottom 0.152: EPAPER_1.5 121.19,18.82 121.19,19.22 124.24,22.27 124.24,35.07 121.6,37.71 119.97,37.71 119.36,38.32 119.36,39.54 120.99,41.17 EPAPER_2.5
  Bottom 0.2: U$2.17 117.85,44.42 EPAPER_2.5
DR_ALL_O_SPIFLASH_COPI  (via drill 0.35)
  Top 0.2: v111.6,61.9 109.36,59.66 U$2.29
  Bottom 0.2: FLASH.10 116.82,61.9 v111.6,61.9
DR_ALL_O_SPIFLASH_CS
  Bottom 0.2: FLASH.12 115.58,63.2 109.47,63.2 U$2.31
DR_ALL_O_SPIFLASH_SCK
  Bottom 0.2: FLASH.6 114.58,54.58 U$2.25
DR_ALL_RESET
  Top 0.2: U$1.7 53.65,15 43,15 35.96,7.96 J3.2
DR_ALL_RX_IN
  Bottom 0.2: USB-UART_1.2 116.72,85.17 U$3.1
DR_ALL_TX_OUT
  Bottom 0.2: U$2.34 107.35,66.16 109.16,66.16 110.5,67.5 110.5,74 116.19,79.69 USB-UART_1.4
DR_CLOCK
  Bottom 0.406: CLOCK_OUT.1 20.5,25.5 32.27,13.73 U$1.1
  pour Bottom: 16.3,25.4 16.5,25.2 20.3,25.2 32.1,13.4 47.3,13.4 47.4,13.4 47.6,13.6 47.6,13.8 47.4,14 45.4,14 32.4,14 30.5,15.9 20.6,25.8 18.5,25.8 16.6,25.8 16.5,25.7 16.3,25.5
DR_MUX
  Top 0.2: U$1.5 52.4,13.71 R36.2 52.4,8.67 MUX.1
DR_OPEN8_VDD
  Top 0.406: POWER.6 30.7,78.7 45.2,78.7 77.1,46.8 77.1,21.2 C38.1 C37.1 74,17.6 74,15.03 U$1.21
  pour Top: 28.9,77.6 30.3,79 45.4,79 77.4,47 77.4,21 75.2,18.8 72.1,18.8 71.9,19 71.9,19.3 72,19.4 75,19.4 76.9,21.3 76.9,46.7 45.2,78.4 30.3,78.4 29.5,77.6
DR_VBN
  Top 0.406: VBN.1 84.5,7.6 C35.1 C36.1 89.16,9.76 89.16,14.95 U$1.36
DR_VBP
  Top 0.406: VBP.2 98.83,6.27 C34.1 C32.1 92.6,10 92.6,13.31 U$1.37
DR_VDD
  Top 0.406: POWER.4 30.46,81 67.9,81 C28.1 C33.1 103.2,43.2 104.4,43.2 | U$2.15 107.15,43.2 104.4,43.2 | VBP.1 104.4,9.13 104.4,43.2
  pour Top: 28.6,79.8 30.1,81.3 68,81.3 102.7,46.6 102.7,43.9 103.3,43.3 104.7,43.3 104.7,8.5 99.7,3.5 98.7,3.5 98.7,3.6 104.1,9 104.1,43 103,43 102.2,43.8 102.2,46.4 68.1,80.5 30.1,80.5 29,79.4
GND  (via drill 0.35, 0.4)
  Top 0.152: 94.16,10.49 96.4,10.49 C34.2 | 86.65,10.49 87.87,10.49 C36.2 | 86.65,10.49 85.63,10.49 C35.2 85.43,10.28 82.79,7.64 82.79,5.81 84.41,4.19 84.41,3.78 VBN.2 | 86.65,10.49 86.65,14.96 87.87,16.17 U$1.34 88.07,16.38 89.09,17.39 90.91,17.39 | 94.16,10.49 94.16,14.14 93.15,15.16 92.54,15.16 91.73,15.97 91.73,16.58 90.91,17.39 | 94.16,10.49 C32.2 | C38.2 74.86,20.85 72.63,20.85 C37.2 72.42,20.85 71.41,19.83 71.41,15.77 70.19,14.55 70.19,13.74 U$1.19 | C41.2 56.17,20.85 58.4,20.85 C42.2 58.61,20.85 60.03,20.85 | 60.03,20.85 60.84,20.85 C39.2 61.04,20.85 63.48,20.85 C40.2 | 60.03,20.85 60.03,16.38 U$1.12 59.82,16.17 59.01,16.17 57.79,14.96 56.17,14.96 | 56.17,14.96 56.17,10.28 50.68,4.8 50.68,4.39 MUX.2 | 56.17,14.96 54.95,16.17 U$1.8 | EPAPER_2.7 121.19,46.45 121.19,47.06 123.83,49.7 123.83,56.61 122.82,57.63 FLASH.3 122.61,57.83 121.8,57.83 | 121.8,57.83 120.38,57.83 FLASH.4 | 121.8,57.83 121.8,68.4 122.41,69.01 122.41,73.68 123.63,74.9 123.63,80.59 USB-UART_1.1 | 100.67,45.44 100.67,44.01 C33.2 100.46,43.81 90.91,34.26 90.91,17.39 | C28.2 100.67,46.45 100.67,45.54 100.57,45.44 v99.78,45.44 | U$2.24 105.75,51.94 105.75,50.92 104.73,49.91 104.73,48.08 105.75,47.06 U$2.20 | EPAPER_1.7 120.99,23.9 119.97,23.9 116.52,27.35 116.11,27.35 C13.2 116.11,27.55 C14.2 116.11,30.2 C11.2 | C11.2 116.11,51.94 C12.2 115.91,52.14 113.47,52.14 108.59,57.02 U$2.27 | C11.2 | U$3.22 72.83,82.83 73.84,82.83 75.06,84.04 89.29,84.04 90.3,85.06 U$3.7 | C27.2 51.9,89.53 49.66,89.53 C26.2 49.46,89.53 v41.94,89.53 | 16.34,85.47 14.71,87.09 12.88,87.09 12.27,86.48 10.65,86.48 C1.2
  Top 0.152: 16.34,85.47 16.34,84.65 IC2.9 | 16.34,85.47 17.15,86.28 19.18,86.28 IC2.8 | 16.34,85.47 IC2.9 | C3.2 10.65,75.92 11.67,75.92 12.88,77.14 14.92,77.14 16.95,75.1 IC3.9 16.54,74.49 16.54,69.9 | R3.2 22.03,79.57 22.03,81.4 C2.2 21.83,81.61 18.57,81.61 16.54,83.64 16.54,84.45 IC2.9 | 28.12,57.83 28.12,62.91 C9.2 28.12,63.11 28.12,65.35 C10.2 27.92,65.55 26.3,65.55 22.03,69.82 R24.2 | 28.12,57.83 28.94,57.02 CLOCK_GND.2 | 28.12,57.83 27.31,57.02 26.7,57.02 CLOCK_GND.1 | 12.5,17.82 13.49,17.82 IC5.3 | C15.2 9.84,20.25 8.21,20.25 8.21,25.93 5.98,28.16 WAKEUP_SIGNAL.1 | 14.31,13.75 14.51,13.55 14.51,12.13 14.31,11.92 | 14.31,13.75 13.7,14.36 13.7,14.97 C5.2 | 14.31,11.92 13.7,11.92 IC4.3 | v18.78,16.6 18.78,16.39 19.59,15.58 C8.2 | 14.31,13.75 v14.51,13.96 | 18.98,7.27 18.98,10.78 U1.3 | 13.1,3.98 12.07,3.98 11.56,4.5 | 11.56,4.5 11.06,5 S1.3 | 14.31,11.92 14.31,11.72 14.92,11.11 15.93,11.11 16.14,10.91 16.14,9.08 11.56,4.5
  Top 0.2: IC4.3 13.55,10.05 C6.2 13.4,10 | S1.3 4.9,5 1.7,8.2 1.7,13.4 3.71,15.41 3.71,15.6 | 3.71,15.6 3.71,26.11 | 3.71,26.11 WAKEUP_SIGNAL.1 | 3.71,26.11 3.71,52.6 | 3.71,52.6 3.71,52.94 GND.2 GND.1 GND.3 GND.5 10.33,62.1 17.1,62.1 | GND.6 GND.4 3.73,52.62 3.71,52.6 | U3.3 6.7,10 13.4,10 | 18.98,7.27 17.72,6 15.5,6 14.5,5 14.5,4.58 13.9,3.98 13.1,3.98 | R5.2 12.5,9.1 13.4,10 | 12.5,17.82 11.38,16.7 8.9,16.7 8.8,16.6 7.3,16.6 6.75,17.15 U2.3 6.15,15.05 C7.2 4.31,15 3.71,15.6
  Top 0.406: R24.2 C4.2 | R24.2 19.21,67.11 IC1.8 18.41,66.91 IC1.9 16.5,62.2 16.6,62.1 17.1,62.1 C25.2 | R24.2 16.54,69.9 13,69.9 C22.2 | IC2.8 19.21,86.61 R1.2 | IC3.9 18.41,76.41 IC3.8 19.21,76.61 R3.2
  Bottom 0.152: U$1.12 60.03,16.17 61.04,15.16 67.75,15.16 69.17,13.74 69.98,13.74 U$1.19 70.19,13.53 71.2,12.52 73.23,12.52 74.25,13.53 75.06,13.53 U$1.23 75.27,13.74 76.49,14.96 78.11,14.96 78.92,15.77 78.92,16.58 79.74,17.39 85.83,17.39 86.85,16.38 87.87,16.38 U$1.34 | v99.78,45.44 104.33,45.44 105.75,46.86 U$2.20 105.95,46.86 107.17,45.64 107.17,38.93 108.39,37.71 108.39,36.9 U$2.11 | 107.17,54.17 107.37,54.38 107.37,56 108.39,57.02 U$2.27 | 107.17,54.17 105.95,52.95 105.95,52.14 U$2.24 | 107.17,54.17 107.98,53.36 114.08,53.36 118.35,57.63 120.17,57.63 FLASH.4 | POWER_2.5V.1 34.63,96.85 v41.94,89.53 41.94,88.92 45.6,85.26 | 45.6,85.26 46.82,84.04 70.39,84.04 71.61,82.83 72.63,82.83 U$3.22 | v18.78,16.6 17.15,16.6 v14.51,13.96 | 45.6,85.26 30.77,70.43 30.77,58.64 29.14,57.02 CLOCK_GND.2 | USB-UART_1.1 123.63,80.79 123.22,80.79 117.74,86.28 91.52,86.28 90.51,85.26 U$3.7
  other vias: 45,41.5 49,41.5 45,37.5 49,37.5 53,41.5 57,41.5 53,37.5 57,37.5 45,49.5 49,49.5 45,45.5 49,45.5 53,49.5 57,49.5 53,45.5 57,45.5 45,25.5 49,25.5 45,21.5 49,21.5 53,25.5 57,25.5 53,21.5 45,33.5 49,33.5 45,29.5 49,29.5 53,33.5 57,33.5 53,29.5 57,29.5 45,57.5 45,53.5 49,53.5 45,65.5 49,65.5 45,61.5 49,61.5 49,57.5 53,57.5 53,53.5 57,53.5 57,57.5 45,69.5 61,41.5 61,37.5 61,49.5 61,45.5 61,25.5 61,33.5 61,29.5 61,53.5 69,61.5 73,61.5 69,57.5 73,57.5 69,65.5 65,65.5 65,69.5 65,73.5 61,73.5 61,69.5 69,73.5 73,73.5 69,69.5 73,69.5 69,77.5 65,77.5 61,77.5 57,77.5 53,77.5 57,73.5 73,65.5 77,65.5 77,61.5 77,57.5 81,57.5 81,61.5 85,57.5 89,53.5 93,49.5 97,45.5 81,53.5 81,49.5 85,49.5 85,53.5 89,49.5 93,45.5 97,41.5 101,37.5 89,45.5 93,41.5 81,45.5 85,45.5 89,41.5 93,37.5 89,33.5 93,33.5 89,29.5 89,25.5 93,25.5 93,29.5 89,21.5 93,21.5 97,33.5 101,33.5 97,29.5 97,25.5 101,25.5 101,29.5 97,21.5 101,21.5 81,41.5 85,41.5 81,37.5 81,33.5 85,33.5 85,37.5 81,29.5 85,29.5 89,37.5 97,37.5 85,25.5 85,21.5 81,21.5 81,25.5 73,37.5 69,37.5 69,33.5 69,29.5 69,25.5 73,25.5 73,29.5 73,33.5 69,41.5 73,41.5 73,45.5 69,45.5 69,49.5 77,53.5 77,77.5 81,73.5 85,69.5 89,65.5 93,61.5 97,57.5 101,53.5 101,57.5 101,61.5 101,65.5 101,69.5 101,73.5 101,77.5 81,77.5 85,77.5 89,77.5 93,77.5 97,77.5 97,73.5 97,69.5 97,65.5 97,61.5 93,65.5 93,69.5 93,73.5 89,73.5 85,73.5 89,69.5 95,95.5 99,95.5 87,95.5 91,95.5 111,95.5 115,95.5 103,95.5 107,95.5 79,95.5 83,95.5 71,95.5 75,95.5 47,95.5 51,95.5 39,95.5 43,95.5 63,95.5 67,95.5 55,95.5 59,95.5 23,95.5 27,95.5 19,95.5 15,95.5 11,95.5
  pour Bottom (rank 2): 0,100 126.5,100 126.5,0 0,0
  pour Top (rank 2): 0,0 126.5,0 126.5,100 0,100
IN_1
  Top 0.2: 13.79,64.41 IC1.3
  Top 0.406: 1.8V.2 6.37,65.1 C22.1 13.1,65.1 | 13.1,65.1 13.25,65.1 IC1.2 | 13.1,65.1 13.79,64.41
  pour Top: 6.4,64.8 13.1,64.8 13.4,64.5 14.2,64.5 14.2,65.6 13.6,65.6 13.4,65.6 13.2,65.4 6.7,65.4 6.3,65.4 6.2,65.3 6.2,65
IN_2
  Top 0.406: 13.05,84.6 C1.1 6.67,84.6 1.2V.2 | 13.05,84.6 13.25,84.6 IC2.2 | 13.05,84.6 IC2.3
  pour Top: 6,85 6.7,84.3 12.9,84.3 13.5,83.7 13.8,83.7 14,83.9 14,85 13.3,85 13.2,84.9 10.5,84.9 6.8,84.9 6.5,85.2 6.2,85.2
IN_3
  Top 0.406: 0.7V.2 6.67,74.1 C3.1 12.75,74.1 | 12.75,74.1 IC3.2 | 12.75,74.1 13.55,74.1 IC3.3
  pour Top: 6,74.5 6.7,73.8 10.7,73.8 13.6,73.8 13.7,73.9 14.1,74.3 14.1,74.7 13.8,75 13.7,75 13.4,75 13,74.6 12.8,74.4 11.2,74.4 6.8,74.4 6.6,74.6 6.5,74.7 6.2,74.7
N$1
  Top 0.406: IC2.7 21.73,85.13 R2.2 22.1,87.5 R1.1
N$2
  Top 0.406: IC3.7 21.73,75.14 R4.2 22,75.6 R3.1
N$10
  Top 0.2: S1.1 R34.1
N$18
  Top 0.2: 22.1,68 R24.1
  Top 0.406: IC1.7 21.73,65.64 R25.2 22.1,68
NOT_Q  (via drill 0.35)
  Top 0.2: IC4.4 16.85,11.85 17.95,12.95 18.1,12.95 | 18.1,12.95 U1.1 | IC5.1 14.3,19.9 17.4,19.9 18.1,19.2 v18.1,15.6 | v18.1,13.5 18.1,12.95
  Bottom 0.2: v18.1,15.6 v18.1,13.5
NOT_Q_AND_SW
  Top 0.2: U1.4 23.3,9.5 28,9.5 J3.1
NOT_WAKEUP_SIGNAL
  Top 0.2: IC5.2 13.5,18.45 12.25,18.45 10.95,17.15 U2.4
OUT_0.7V
  Top 0.406: IC3.6 21.53,73.86 | 21.53,73.86 C4.1 | 21.53,73.86 22.27,73.86 | 22.27,73.86 R4.1 | 22.27,73.86 25.87,73.86 POWER.7
  pour Top: 19.9,73.4 25.8,73.4 26.4,74 26.4,74.3 26.3,74.4 26,74.4 25.5,73.9 19.4,73.9
OUT_1.2V
  Top 0.406: IC2.6 21.53,83.87 | 21.53,83.87 C2.1 24.2,83.4 24.8,82.8 24.8,78.5 26.23,77.07 POWER.5 | 21.53,83.87 22.27,83.87 R2.1
  Bottom 0.406: POWER.5 25.1,75.64 25.1,73.7 26.23,72.57 POWER.9
  pour Top: 19.2,84.1 22.3,84.1 22.8,84.6 23.9,85.7 23.9,85 23.6,84.7 22.5,83.6 19.8,83.6 19.7,83.6
  pour Top: 22.5,83.1 24,83.1 24.5,82.6 24.5,81.7 24.5,78.3 26,76.8 26.4,76.8 26.5,76.9 26.5,77.1 25.1,78.5 25.1,82.9 24.6,83.4 24.4,83.6 22.2,83.6 21.5,83.6 21.5,83.1
OUT_1.8V
  Top 0.406: CLOCK_VDD.1 16.5,40.5 CLOCK_VDD_1.8.1 19.8,57 23.8,61 23.8,63 22.9,63.9 C25.1 21.53,64.36 | IC1.6 21.53,64.36 | 21.53,64.36 22.27,64.36 R25.1
  pour Top: 19.3,64.2 22.3,64.2 23.5,63 23.5,61.2 21.5,59.2 19.7,57.4 16.5,57.4 16.1,57 16.1,56.4 16.1,40.4 22.8,33.7 28.9,27.6 29.5,27.6 29.8,27.9 29.8,28.3 17,41.1 17,44.9 17,56.3 17.3,56.6 19.6,56.6 19.9,56.6 24.1,60.8 24.1,63.1 23,64.2 22.6,64.6 19.6,64.6 19.3,64.6 19.2,64.5 19.2,64.3
Q  (via drill 0.35)
  Top 0.2: IC5.4 15.45,16.95 v15.4,16.9 | IC4.2 11.7,12.5 v11.4,12.2
  Bottom 0.2: v11.4,12.2 11.4,12.9 v15.4,16.9 11.9,20.4 11.9,29.4 OUTPUT_ENABLE.1
RESET
  Top 0.2: 11,13.2 R29.2 | 9.7,11.9 11,13.2 | IC4.1 11.05,13.15 11,13.2 | R5.1 9.7,11.2 9.7,11.9 | U3.4 8.75,10.95 9.7,11.9
RST_SW
  Top 0.2: S1.2 17.3,8.8 17.3,10.7 18.6,12 U1.2
  Bottom 0.2: S1.2 15,3.5 27.08,3.5 J3.3
VCCQ
  Top 0.406: POWER.2 34.42,87.5 90.69,87.5 | 90.69,87.5 U$3.5 | 90.69,87.5 99.5,87.5 103.6,83.4 103.6,56.91 U$2.26 107.21,53.3 109.5,53.3 110.5,52.3 110.5,36.29 U$2.9
  Bottom 0.406: U$2.9 110.5,32.23 110.5,19 103,11.5 87.5,11.5 | U$1.32 86.72,14.95 86.72,12.28 87.5,11.5 | 87.5,11.5 69.85,11.5 | U$1.17 69.85,11.5 | 69.85,11.5 52.07,11.5 U$1.3
  pour Top: 28.6,82.1 34.3,87.8 99.6,87.8 104,83.4 104,56.9 106.3,54.6 105.4,54.6 103.5,56.5 103.5,83 99.5,87 34.8,87 29.2,81.4 28.6,81.4
  pour Top: 107,53.1 109.3,53.1 110.3,52.1 110.3,36.3 108.2,34.2 108.2,34.1 108.4,33.9 108.6,33.9 110.9,36.2 110.9,52.4 109.8,53.5 107.4,53.5 106.3,54.6 106.1,54.6 105.9,54.4 105.9,54.1
  pour Bottom: 108.2,34.1 110.2,32.1 110.2,28.5 110.2,19.3 102.8,11.9 52.1,11.9 51.1,12.9 50,14 49.7,14 49.6,13.9 49.6,13.6 52,11.2 54.2,11.2 103.1,11.2 110.7,18.8 110.9,19 110.9,25.7 110.9,32.2 108.9,34.2 108.7,34.4 108.5,34.4
VDD_2.5V
  Top 0.152: 16.8,16.19 16.75,16.19 16.8,16
  Top 0.2: 7.95,13.9 7.95,12.55 U3.5
  Top 0.406: POWER.12 29.07,69.15 29.9,68.32 C10.1 C9.1 32,60.9 32,28.46 CLOCK_VDD.2 29,25.16 22.2,18.36 | 22.2,18.36 21.6,17.76 21.6,15.7 C8.1 21.4,14.2 | 21.4,14.2 21.4,13.3 U1.5 20.5,11.7 20.5,9.4 24.4,5.5 R34.2 26,3.4 42.3,3.4 48.4,9.5 R36.1 | 21.4,14.2 21.3,14.3 16.8,14.3 | C5.1 16.1,14.3 | 16.8,14.3 16.1,14.3 | 16.1,14.3 16.1,13.8 IC4.5 | IC5.5 16.45,19.15 16.8,18.8 16.8,16.19 16.8,16.06 11.16,16.06 R29.1 8.9,15.9 7.95,14.95 | 16.8,14.3 16.8,16 | C7.1 7.95,14.95 | 7.95,14.95 7.95,13.9 4.7,13.9 3.7,12.9 3.7,9.2 4.8,8.1 13.5,8.1 C6.1 | 22.2,18.36 19.86,20.7 13,20.7 10.9,18.6 C15.1 9.85,18.45 U2.5
  pour Top: 30,62.6 31.6,61 31.6,28.6 28.5,25.5 28.5,24.5 32.3,28.3 32.3,61.1 30,63.4 29.9,63.4 29.8,63.3 29.8,62.7 29.9,62.6
  pour Top: 29.7,68.6 29.7,62.7 30,62.7 30,68.6
  pour Top: 28.4,26 28.4,25.2 22.2,19 21.3,18.1 21.3,15.6 21.3,15.4 21.7,15 21.7,17.6 22.2,18.1 29.5,25.4 29.5,25.5 29,26 28.9,26
VDD_2.5V_IN
  Top 0.406: 1.8V.1 0.7V.1 1.2V.1 11,92.27 26.23,92.27 | 26.23,92.27 POWER.1 POWER.3 26.23,78.81 27.5,77.54 27.5,70.42 POWER.11 | 26.23,92.27 27.23,92.27 POWER_2.5V.2 36.46,92.5 106.5,92.5 113,86 113,82.4 | C12.1 113,56.9 113,82.4 | C12.1 C11.1 | C11.1 118.51,48.89 EPAPER_2.8 | C11.1 C14.1 C13.1 119.01,26.39 EPAPER_1.8 | C12.1 120.23,54.33 FLASH.2 FLASH.1 | USB-UART_1.3 116.95,82.4 113,82.4
  pour Top: 31.4,96.2 35.7,91.9 106,91.9 112,85.9 112,57.5 117.6,51.9 117.6,27.2 118.2,27.06 118.2,52.4 113.2,57.4 113.2,86.2 106.6,92.8 36.5,92.8 32.2,97.1 31.9,97.1 31.4,96.6
  pour Top: 31.5,96.9 27.2,92.6 24.6,92.6 10.8,92.6 4.6,86.4 3.4,85.2 3.4,82.9 3.4,63.8 4.2,63.8 4.3,63.9 4.4,64 4.4,85.2 10.9,91.7 26.5,91.7 27.7,91.7 31.7,95.7 32,96 32,96.6 31.7,96.9
  pour Top: 26,92 26,78.5 27.2,77.3 27.2,70.7 26,69.5 26,69 26.5,69 27.8,70.3 27.8,77.7 26.5,79 26.5,92
VDDH
  Top 0.406: POWER.10 29.87,71.69 34.9,66.66 34.9,23.7 39.5,19.1 C41.1 C42.1 58.5,17.31 U$1.10
  pour Top: 29.6,71.5 34.5,66.6 34.5,23.5 39.3,18.7 47.1,18.7 58.8,18.7 59,18.9 59,19.1 58.7,19.4 56.3,19.4 39.4,19.4 35.1,23.7 35.1,66.9 30.3,71.7 30,72 29.7,72 29.5,71.8 29.5,71.7 29.5,71.6
VDDLS
  Top 0.406: POWER.8 31.54,77 41.8,77 65,53.8 65,20.6 C40.1 C39.1 61.22,18.88 61.22,15.05 U$1.13
  pour Top: 29.1,74.9 31.4,77.2 42,77.2 65.4,53.8 65.4,20.6 63.6,18.8 61,18.8 60.7,19.1 61,19.4 63.4,19.4 64.7,20.7 64.7,53.7 41.7,76.7 31.9,76.7 29.1,73.9
WAKEUP_SIGNAL
  Top 0.2: WAKEUP_SIGNAL.2 4.5,24.36 4.5,18.6 5.3,17.8 U2.2

### Text on the board
tPlace: VCCQ | VDD | OPEN8 | TX | RX | VDDLS | VDDH | 2.5V | 2.5V | CS | COPI | CIPO | SCK | VDD | OE | GND | DIN | CLK | CS | DC | RST | BUSY | DIN | GND | 1.8V | WS | VDD | 2.5V | GND | DIN | CLK | CS | DC | RST | BUSY | 0 | 1
tNames: Open8 Epaper Demo Board - SOTB V1.0 / Copyright © UEC PHAM LAB 2022 | SW_RST | top